# Altium project DashDataDisplay.PrjPcb (part 2 of 2)

## Sheet ADCCircuit.SchDoc
size 420 x 297 mm; SheetNumber: 6; SheetTotal: 9
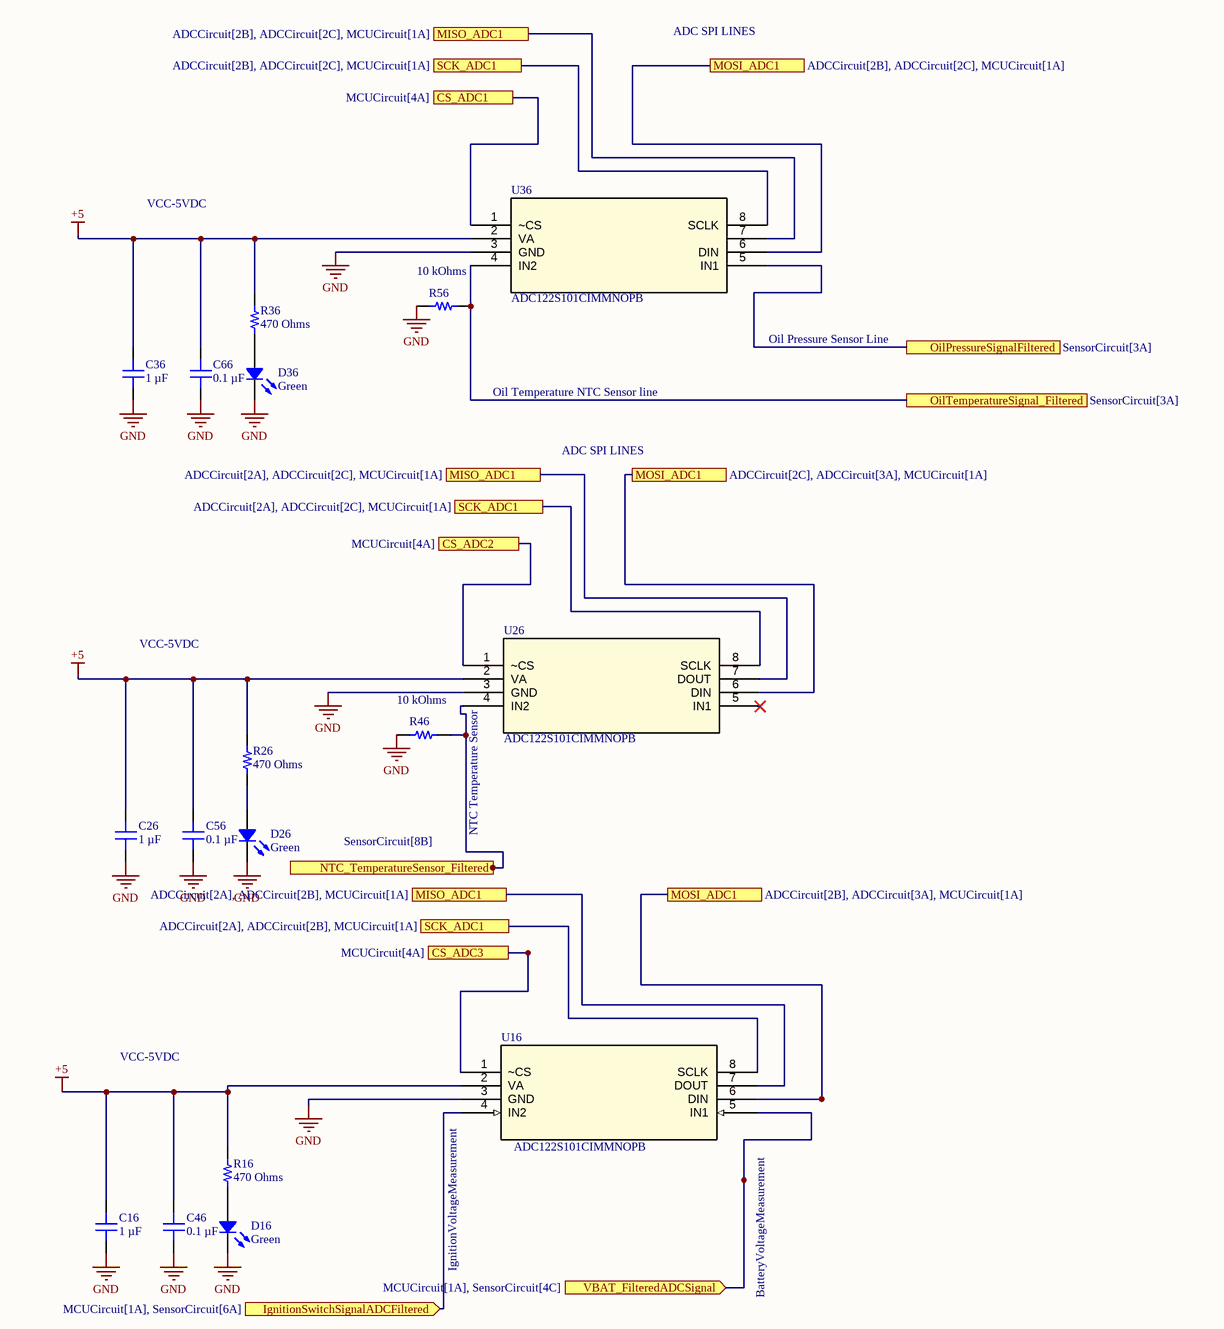
[diagram p6: ADCCircuit.SchDoc]

### Parts
C16  1 µF  [C0805]
C26  1 µF  [C0805]
C36  1 µF  [C0805]
C46  0.1 µF  [C0805]
C56  0.1 µF  [C0805]
C66  0.1 µF  [C0805]
D16  Green  [LED 0805_2012 GREEN]
D26  Green  [LED 0805_2012 GREEN]
D36  Green  [LED 0805_2012 GREEN]
R16  470 Ohms  [RES 0805_2012]
R26  470 Ohms  [RES 0805_2012]
R36  470 Ohms  [RES 0805_2012]
R46  10 kOhms  [RES 0805_2012]
R56  10 kOhms  [RES 0805_2012]
U16  ADC122S101CIMMNOPB  [MUA08A]
U26  ADC122S101CIMMNOPB  [MUA08A]
U36  ADC122S101CIMMNOPB  [MUA08A]

### Ports
CS_ADC1 (see MCUCircuit[4A]), CS_ADC2 (see MCUCircuit[4A]), CS_ADC3 (see MCUCircuit[4A]), IgnitionSwitchSignalADCFiltered (in, see MCUCircuit[1A], SensorCircuit[6A]), MISO_ADC1 (see ADCCircuit[2A], ADCCircuit[2B], MCUCircuit[1A]), MISO_ADC1 (see ADCCircuit[2A], ADCCircuit[2C], MCUCircuit[1A]), MISO_ADC1 (see ADCCircuit[2B], ADCCircuit[2C], MCUCircuit[1A]), MOSI_ADC1 (see ADCCircuit[2B], ADCCircuit[2C], MCUCircuit[1A]), MOSI_ADC1 (see ADCCircuit[2B], ADCCircuit[3A], MCUCircuit[1A]), MOSI_ADC1 (see ADCCircuit[2C], ADCCircuit[3A], MCUCircuit[1A]), NTC_TemperatureSensor_Filtered (see SensorCircuit[8B]), OilPressureSignalFiltered (see SensorCircuit[3A]), OilTemperatureSignal_Filtered (see SensorCircuit[3A]), SCK_ADC1 (see ADCCircuit[2A], ADCCircuit[2B], MCUCircuit[1A]), SCK_ADC1 (see ADCCircuit[2A], ADCCircuit[2C], MCUCircuit[1A]), SCK_ADC1 (see ADCCircuit[2B], ADCCircuit[2C], MCUCircuit[1A]), VBAT_FilteredADCSignal (in, see MCUCircuit[1A], SensorCircuit[4C])

### Nets
+5: C16.2 C26.2 C36.2 C46.2 C56.2 C66.2 R16.2 R26.2 R36.2 U16.2(VA) U26.2(VA) U36.2(VA)
GND: C16.1 C26.1 C36.1 C46.1 C56.1 C66.1 D16.2 D26.2 D36.2 R46.1 R56.1 U16.3(GND) U26.3(GND) U36.3(GND)
NetC72_2: U36.5(IN1) ; port OilPressureSignalFiltered
NetC82_2: R56.2 U36.4(IN2) ; port OilTemperatureSignal_Filtered
NetC152_2: R46.2 U26.4(IN2) ; port NTC_TemperatureSensor_Filtered
NetD16_1: D16.1 R16.1
NetD26_1: D26.1 R26.1
NetD36_1: D36.1 R36.1
NetR75_1: U16.8(SCLK) U26.8(SCLK) U36.8(SCLK) ; port SCK_ADC1
NetR85_1: U16.6(DIN) U26.6(DIN) U36.6(DIN) ; port MOSI_ADC1
NetR92_2: U16.5(IN1) ; port VBAT_FilteredADCSignal
NetR95_1: U16.7(DOUT) U26.7(DOUT) U36.7(DOUT) ; port MISO_ADC1
NetR222_2: U16.4(IN2) ; port IgnitionSwitchSignalADCFiltered
NetU15_17: U36.1(~CS) ; port CS_ADC1
NetU15_18: U26.1(~CS) ; port CS_ADC2
NetU15_33: U16.1(~CS) ; port CS_ADC3

Not connected (* = marked no-connect by the designer): U26 5(IN1)*

### Notes on the sheet
- ADC SPI LINES
- VCC-5VDC
- Oil Pressure Sensor Line
- Oil Temperature NTC Sensor line
- NTC Temperature Sensor
- (near U16) IgnitionVoltageMeasurement
- (near U16) BatteryVoltageMeasurement
- THIS DOCUMENT AND THE DATA DISCLOSED HEREIN OR
- HEREWITH IS THE PROPERTY OF ALTIUM LIMITED AND MAY
- DWG NO:
- REVISION
- REV:
- DESCRIPTION
- DATE
- APPROVED
- BE FREELY DISTRIBUTED IN WHOLE. NO RIGHTS ARE
- RESERVED OR EXPRESS OR IMPLIED WARANTEE GIVEN.
- ENG:
- APPROVALS
- PROJECT
- DSN:
- CHK:
- REFERENCE DOCUMENTS
- PROJECT REVISION:
- TITLE
- DOCUMENT REVISION:
- DESIGN ITEM:
- BOM:
- FAB DWG:
- PCB DWG:
- ASSY DWG:
- SCALE:
- A3
- SIZE
- CAGE CODE
- FILE NAME
- DWG NO.
- SHEET
- OF
- REV

### Library data of the parts
C16 C26 C36 = EMK212B7105KGHTR: CAP CER 1UF 16V X7R 0805; manufacturer: Taiyo Yuden; Tolerance: ±10%; Part Number: EMK212B7105KGHTR; Value: 1 µF; Applications: Automotive; Capacitance: 1 µF; componentlink1description: Datasheet; componentlink1url: https://ds.yuden.co.jp/TYCOMPAS/ut/detail?pn=EMK212B7105KGHTR &u=M; componentlink2description: DigiKey Link; componentlink2url: https://www.digikey.com/en/products/detail/taiyo-yuden/EMK212B7105KGHTR/6563155; Device Package: 0805 (2012 Metric); lastupdated: 2/9/2024 20:16:06; Lifecycle Status: Active; Minimum Order: 1; Mounting Type: Surface Mount, MLCC; Operating Temperature: -55°C ~ 125°C; Package / Case: 0805 (2012 Metric); packaging: TapeAndReel; partid: 3641; Part Status: Active; price: 0.03; Ratings: AEC-Q200; series: M; Size / Dimension: 0.079" L x 0.049" W (2.00mm x 1.25mm); Supplier 1: DigiKey; Supplier Part Number 1: 587-6310-1-ND; Temperature Coefficient: X7R; Thickness (Max): 0.053" (1.35mm); Voltage - Rated: 16V
C46 C56 C66 = 0805B104K160CT: CAP CER 0.1UF 16V X7R 0805; manufacturer: Walsin Technology Corporation; Tolerance: ±10%; Part Number: 0805B104K160CT; Value: 0.1 µF; Applications: General Purpose; Capacitance: 0.1 µF; componentlink1description: Datasheet; componentlink1url: http://www.passivecomponent.com/wp-content/uploads/2018/10/MLCC.pdf; componentlink2description: DigiKey Link; componentlink2url: https://www.digikey.com/en/products/detail/walsin-technology-corporation/0805B104K160CT/9355062; Device Package: 0805 (2012 Metric); lastupdated: 2/9/2024 20:16:02; Lifecycle Status: Active; Minimum Order: 1; Mounting Type: Surface Mount, MLCC; Operating Temperature: -55°C ~ 125°C; Package / Case: 0805 (2012 Metric); packaging: TapeAndReel; partid: 4882; Part Status: Active; price: 0.01; series: -; Size / Dimension: 0.079" L x 0.049" W (2.00mm x 1.25mm); Supplier 1: DigiKey; Supplier Part Number 1: 1292-1565-1-ND; Temperature Coefficient: X7R; Thickness (Max): 0.035" (0.90mm); Voltage - Rated: 16V
D16 D26 D36 = SM0805UGC: LED GREEN CLEAR 0805 SMD; Manufacturer: Bivar Inc.; Configuration: Standard; Current - Test: 20mA; Lens Color: Colorless; Lens Size: 1.40mm x 1.20mm; Lens Style: Rectangle with Flat Top; Millicandela Rating: 10mcd; Viewing Angle: 130°; Voltage - Forward (Vf) (Typ): 2V; Wavelength - Dominant: 565nm; Wavelength - Peak: 563nm; Part Number: SM0805UGC; Color: Green; ComponentLink1Description: Datasheet; ComponentLink1URL: https://www.bivar.com/Files/Datasheets/SM0805UGC.pdf; ComponentLink2Description: DigiKey Link; ComponentLink2URL: https://www.digikey.com/en/products/detail/bivar-inc/SM0805UGC/2408549; Device Package: 0805 (2012 Metric); Height (Max): 1.10mm; LastUpdated: 3/11/2024 07:52:46; Lens Transparency: Clear; Lifecycle Status: Active; Minimum Order: 1; Mounting Type: Surface Mount; Package / Case: 0805 (2012 Metric); Packaging: TapeAndReel; PartId: 247; Part Status: Active; Price: 0.19; Series: -; Size / Dimension: 2.00mm L x 1.20mm W; Supplier 1: DigiKey; Supplier Part Number 1: 492-1329-1-ND; Supplier Device Package: 0805; Value: Green
R16 R26 R36 = AC0805JR-07470RL: RES SMD 470 OHM 5% 1/8W 0805; Manufacturer: Yageo; Power (Watts): 0.125W, 1/8W; Temperature Coefficient: ±100ppm/°C; Part Number: AC0805JR-07470RL; Value: 470 Ohms; ComponentLink1Description: Datasheet; ComponentLink1URL: https://www.yageo.com/upload/media/product/productsearch/datasheet/rchip/PYu-AC_51_RoHS_L_7.pdf; ComponentLink2Description: DigiKey Link; ComponentLink2URL: https://www.digikey.com/en/products/detail/yageo/AC0805JR-07470RL/5897150; Composition: Thick Film; Device Package: 0805 (2012 Metric); Features: Automotive AEC-Q200, Moisture Resistant; Height - Seated (Max): 0.024" (0.60mm); LastUpdated: 2/8/2024 21:01:17; Lifecycle Status: Active; Minimum Order: 1; Number of Terminations: 2; Operating Temperature: -55°C ~ 155°C; Package / Case: 0805 (2012 Metric); Packaging: TapeAndReel; PartId: 46466; Part Status: Active; Price: 0.01; Ratings: AEC-Q200; Resistance: 470 Ohms; Series: AC; Size / Dimension: 0.079" L x 0.049" W (2.00mm x 1.25mm); Supplier 1: DigiKey; Supplier Part Number 1: YAG3791CT-ND; Supplier Device Package: 0805; Tolerance: ±5%
R46 R56 = 9-2176375-1: RES 10K OHM 0.1% 1/5W 0805; Manufacturer: TE Connectivity Passive Product; Power (Watts): 0.2W, 1/5W; Temperature Coefficient: ±10ppm/°C; Part Number: 9-2176375-1; Value: 10 kOhms; ComponentLink1Description: Datasheet; ComponentLink1URL: https://www.te.com/usa-en/product-9-2176375-1.datasheet.pdf; ComponentLink2Description: DigiKey Link; ComponentLink2URL: https://www.digikey.com/en/products/detail/te-connectivity-passive-product/9-2176375-1/18110542; Composition: Thin Film; Device Package: 0805 (2012 Metric); Features: Anti-Sulfur, Automotive AEC-Q200, Moisture Resistant; Height - Seated (Max): 0.026" (0.65mm); LastUpdated: 2/8/2024 21:00:11; Lifecycle Status: Active; Minimum Order: 1; Number of Terminations: 2; Operating Temperature: -55°C ~ 155°C; Package / Case: 0805 (2012 Metric); Packaging: TapeAndReel; PartId: 76290; Part Status: Active; Price: 0.39; Ratings: AEC-Q200; Resistance: 10 kOhms; Series: RQ73; Size / Dimension: 0.079" L x 0.049" W (2.00mm x 1.25mm); Supplier 1: DigiKey; Supplier Part Number 1: 1712-9-2176375-1CT-ND; Supplier Device Package: 0805; Tolerance: ±0.1%
U16 U26 U36 = ADC122S101CIMMNOPB: No Description Available; Mfr_Name: Texas Instruments; Type: ADC122S101CIMM; RefDes: RefDes

## Sheet ThermoCoupleCircuit.SchDoc
size A; SheetNumber: 7; SheetTotal: 9
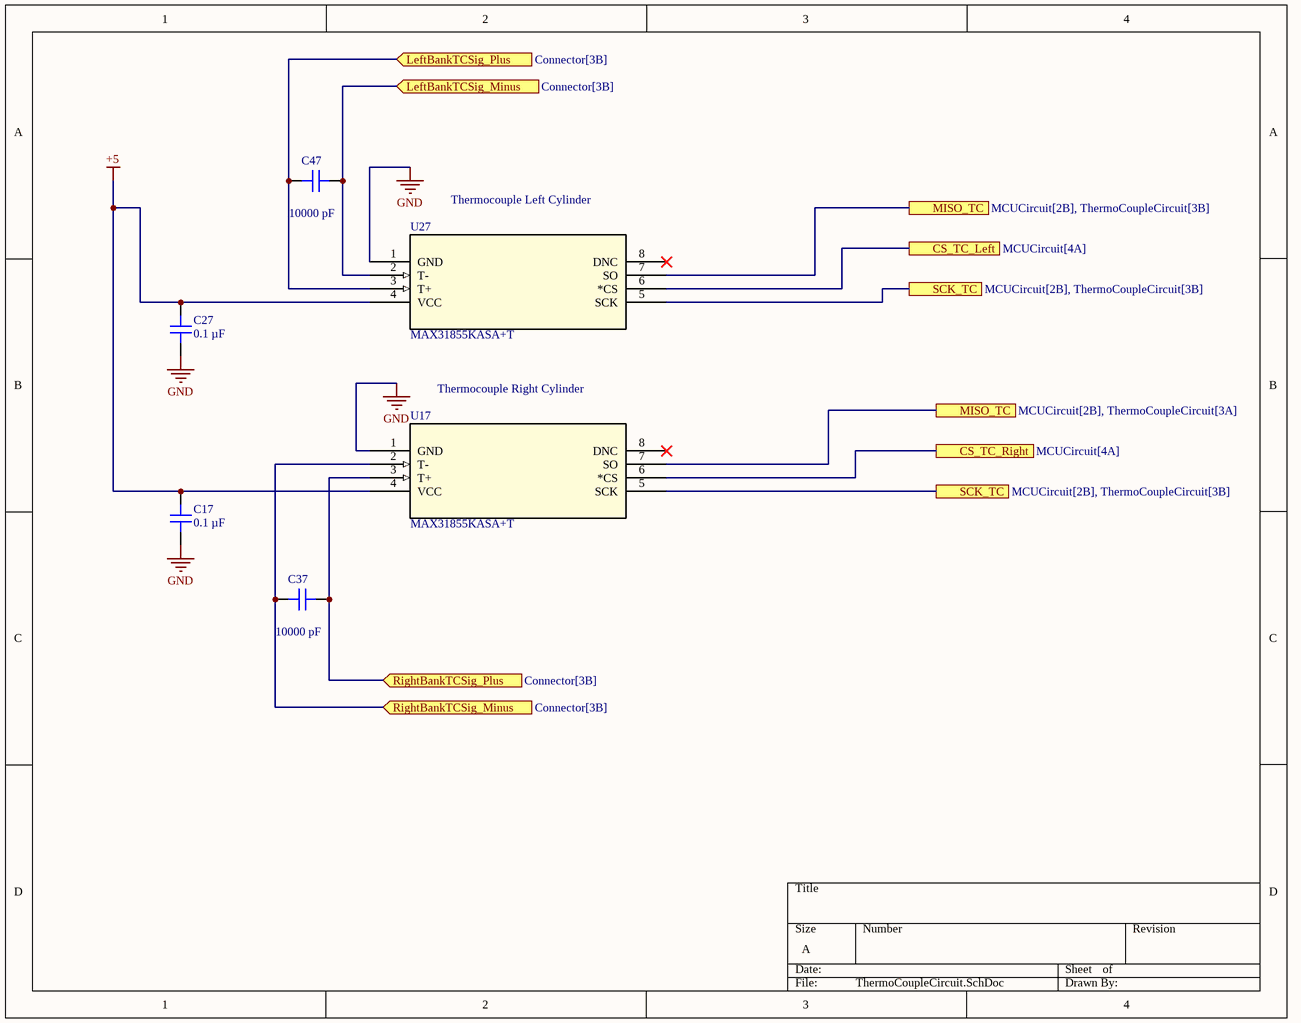
[diagram p7: ThermoCoupleCircuit.SchDoc]

### Parts
C17  0.1 µF  [C0805]
C27  0.1 µF  [C0805]
C37  10000 pF  [C0805]
C47  10000 pF  [C0805]
U17  MAX31855KASA+T  [21-0041B_8_MXM]
U27  MAX31855KASA+T  [21-0041B_8_MXM]

### Ports
CS_TC_Left (see MCUCircuit[4A]), CS_TC_Right (see MCUCircuit[4A]), LeftBankTCSig_Minus (in, see Connector[3B]), LeftBankTCSig_Plus (in, see Connector[3B]), MISO_TC (see MCUCircuit[2B], ThermoCoupleCircuit[3A]), MISO_TC (see MCUCircuit[2B], ThermoCoupleCircuit[3B]), RightBankTCSig_Minus (in, see Connector[3B]), RightBankTCSig_Plus (in, see Connector[3B]), SCK_TC (see MCUCircuit[2B], ThermoCoupleCircuit[3B])

### Nets
+5: C17.2 C27.1 U17.4(VCC) U27.4(VCC)
GND: C17.1 C27.2 U17.1(GND) U27.1(GND)
NetC37_1: C37.1 U17.2(T-) ; port RightBankTCSig_Minus
NetC37_2: C37.2 U17.3(T+) ; port RightBankTCSig_Plus
NetC47_1: C47.1 U27.3(T+) ; port LeftBankTCSig_Plus
NetC47_2: C47.2 U27.2(T-) ; port LeftBankTCSig_Minus
NetLCD14_6: U17.5(SCK) U27.5(SCK) ; port SCK_TC
NetR105_1: U17.7(SO) U27.7(SO) ; port MISO_TC
NetU15_15: U27.6(*CS) ; port CS_TC_Left
NetU15_16: U17.6(*CS) ; port CS_TC_Right

Not connected (* = marked no-connect by the designer): U17 8(DNC)*; U27 8(DNC)*

### Notes on the sheet
- Thermocouple Left Cylinder
- Thermocouple Right Cylinder

### Library data of the parts
C17 C27 = 0805B104K160CT: as C46 on sheet ADCCircuit; Part Number: 0805B104K160CT; Value: 0.1 µF; Applications: General Purpose; Capacitance: 0.1 µF; componentlink1description: Datasheet; componentlink1url: http://www.passivecomponent.com/wp-content/uploads/2018/10/MLCC.pdf; componentlink2description: DigiKey Link; componentlink2url: https://www.digikey.com/en/products/detail/walsin-technology-corporation/0805B104K160CT/9355062; Device Package: 0805 (2012 Metric); lastupdated: 2/9/2024 20:16:02; Lifecycle Status: Active; Minimum Order: 1; Mounting Type: Surface Mount, MLCC; Operating Temperature: -55°C ~ 125°C; Package / Case: 0805 (2012 Metric); packaging: TapeAndReel; partid: 4882; Part Status: Active; price: 0.01; series: -; Size / Dimension: 0.079" L x 0.049" W (2.00mm x 1.25mm); Supplier 1: DigiKey; Supplier Part Number 1: 1292-1565-1-ND; Temperature Coefficient: X7R; Thickness (Max): 0.035" (0.90mm); Voltage - Rated: 16V
C37 C47 = C0805C103K4REC7800: CAP CER 0805 10NF 16V X7R 10%; manufacturer: KEMET; Part Number: C0805C103K4REC7800; Value: 10000 pF; Applications: ESD Protection; Capacitance: 10000 pF; componentlink1description: Datasheet; componentlink1url: https://connect.kemet.com:7667/gateway/IntelliData-ComponentDocumentation/1.0/download/datasheet/C0805C103K4REC7800; componentlink2description: DigiKey Link; componentlink2url: https://www.digikey.com/en/products/detail/kemet/C0805C103K4REC7800/8643796; Device Package: 0805 (2012 Metric); lastupdated: 2/9/2024 20:14:57; Lifecycle Status: Active; Minimum Order: 1; Mounting Type: Surface Mount, MLCC; Operating Temperature: -55°C ~ 125°C; Package / Case: 0805 (2012 Metric); packaging: TapeAndReel; partid: 46019; Part Status: Active; price: 0.03; series: ESD SMD Comm X7R; Size / Dimension: 0.079" L x 0.049" W (2.00mm x 1.25mm); Supplier 1: DigiKey; Supplier Part Number 1: 399-C0805C103K4REC7800CT-ND; Temperature Coefficient: X7R; Thickness (Max): 0.035" (0.88mm); Tolerance: ±10%; Voltage - Rated: 16V
U17 U27 = MAX31855KASA+T: No Description Available; Mfr_Name: Analog Devices Inc; RefDes: RefDes; Type: Type

## Sheet Connector.SchDoc
size A; SheetNumber: 8; SheetTotal: 9
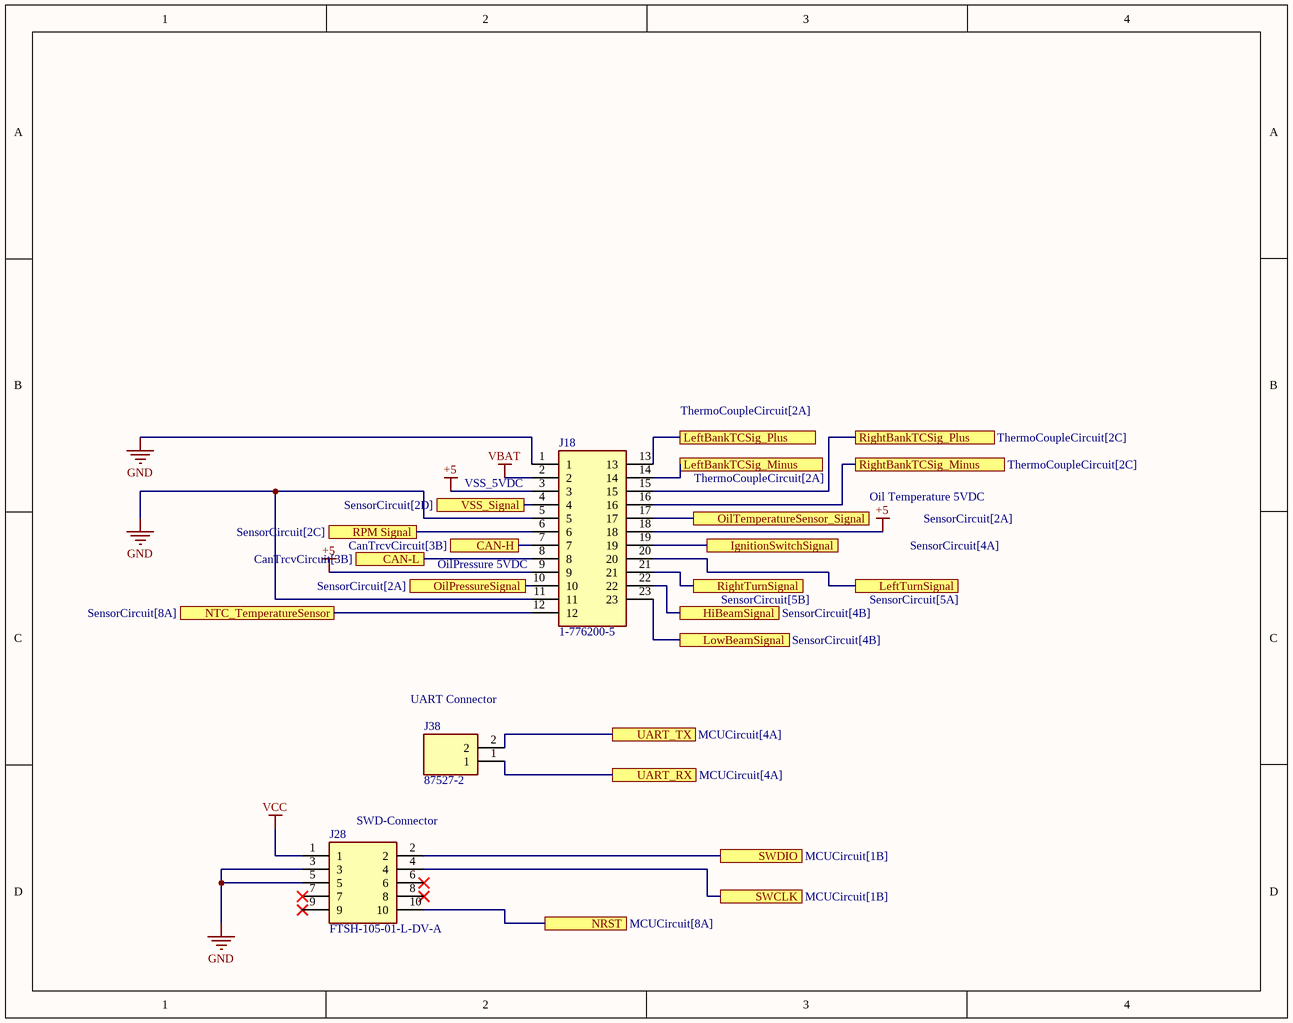
[diagram p8: Connector.SchDoc]

### Parts
J18  1-776200-5  [17762005]
J28  FTSH-105-01-L-DV-A  [FTSH-105-XX-YYY-DV-A]
J38  87527-2  [HDRV2W66P0X254_1X2_467X244X1044P]

### Ports
CAN-H (see CanTrcvCircuit[3B]), CAN-L (see CanTrcvCircuit[3B]), HiBeamSignal (see SensorCircuit[4B]), IgnitionSwitchSignal (see SensorCircuit[4A]), LeftBankTCSig_Minus (see ThermoCoupleCircuit[2A]), LeftBankTCSig_Plus (see ThermoCoupleCircuit[2A]), LeftTurnSignal (see SensorCircuit[5A]), LowBeamSignal (see SensorCircuit[4B]), NRST (see MCUCircuit[8A]), NTC_TemperatureSensor (see SensorCircuit[8A]), OilPressureSignal (see SensorCircuit[2A]), OilTemperatureSensor_Signal (see SensorCircuit[2A]), RightBankTCSig_Minus (see ThermoCoupleCircuit[2C]), RightBankTCSig_Plus (see ThermoCoupleCircuit[2C]), RightTurnSignal (see SensorCircuit[5B]), RPM Signal (see SensorCircuit[2C]), SWCLK (see MCUCircuit[1B]), SWDIO (see MCUCircuit[1B]), UART_RX (see MCUCircuit[4A]), UART_TX (see MCUCircuit[4A]), VSS_Signal (see SensorCircuit[2D])

### Nets
+5: J18.3 J18.9 J18.18
GND: J18.1 J18.5 J18.11 J28.3 J28.5
VBAT: J18.2
VCC: J28.1
NetC37_1: J18.16 ; port RightBankTCSig_Minus
NetC37_2: J18.15 ; port RightBankTCSig_Plus
NetC47_1: J18.13 ; port LeftBankTCSig_Plus
NetC47_2: J18.14 ; port LeftBankTCSig_Minus
NetC235_2: J28.10 ; port NRST
NetJ18_4: J18.4 ; port VSS_Signal
NetJ18_6: J18.6 ; port RPM Signal
NetJ18_7: J18.7 ; port CAN-H
NetJ18_8: J18.8 ; port CAN-L
NetJ18_10: J18.10 ; port OilPressureSignal
NetJ18_12: J18.12 ; port NTC_TemperatureSensor
NetJ18_17: J18.17 ; port OilTemperatureSensor_Signal
NetJ18_19: J18.19 ; port IgnitionSwitchSignal
NetJ18_20: J18.20 ; port LeftTurnSignal
NetJ18_21: J18.21 ; port RightTurnSignal
NetJ18_22: J18.22 ; port HiBeamSignal
NetJ18_23: J18.23 ; port LowBeamSignal
NetJ28_2: J28.2 ; port SWDIO
NetJ28_4: J28.4 ; port SWCLK
NetJ38_1: J38.1 ; port UART_RX
NetJ38_2: J38.2 ; port UART_TX

Not connected (* = marked no-connect by the designer): J28 6* 7* 8* 9*

### Notes on the sheet
- (near J18) VSS_5VDC
- Oil Temperature 5VDC
- (near J18) OilPressure 5VDC
- (near J38) UART Connector
- (near J28) SWD-Connector

### Library data of the parts
J18 = 1-776200-5: Connector; Manufacturer_Name: TE Connectivity; Datasheet Link: https://www.te.com/commerce/DocumentDelivery/DDEController?Action=showdoc&DocId=Customer+Drawing%7F776200%7FE%7Fpdf%7FEnglish%7FENG_CD_776200_E.pdf%7F1-776200-5; Height: 34.25mm; Manufacturer_Part_Number: 1-776200-5; Mouser Part Number: 571-1-776200-5; Mouser Price/Stock: https://www.mouser.co.uk/ProductDetail/TE-Connectivity-AMP/1-776200-5?qs=YqNA2qefETBJbWsdhRcFeA%3D%3D
J28 = FTSH-105-01-L-DV-A: Connector; Manufacturer_Name: SAMTEC; Datasheet Link: http://suddendocs.samtec.com/prints/ftsh-1xx-xx-xxx-dv-xxx-xxx-mkt.pdf; Manufacturer_Part_Number: FTSH-105-01-L-DV-A; Mouser Part Number: 200-FTSH10501LDVA; Mouser Price/Stock: https://www.mouser.co.uk/ProductDetail/Samtec/FTSH-105-01-L-DV-A?qs=vqM95g%252BRBeykLJELFbssPw%3D%3D; Arrow Part Number: FTSH-105-01-L-DV-A; Arrow Price/Stock: https://www.arrow.com/en/products/ftsh-105-01-l-dv-a/samtec
J38 = 87527-2: Connector; Manufacturer_Name: TE Connectivity; Datasheet Link: https://www.te.com/commerce/DocumentDelivery/DDEController?Action=showdoc&DocId=Customer+Drawing%7F87527%7FH%7Fpdf%7FEnglish%7FENG_CD_87527_H.pdf%7F87527-2; Height: 10.439mm; Manufacturer_Part_Number: 87527-2; Mouser Part Number: 571-875272; Mouser Price/Stock: https://www.mouser.co.uk/ProductDetail/TE-Connectivity/87527-2?qs=ZDXmSm13593hsB4j%252B6gMfg%3D%3D; Arrow Part Number: 87527-2; Arrow Price/Stock: https://www.arrow.com/en/products/87527-2/te-connectivity?region=nac

## Sheet ButtonCircuit.SchDoc
size A; SheetNumber: 9; SheetTotal: 9
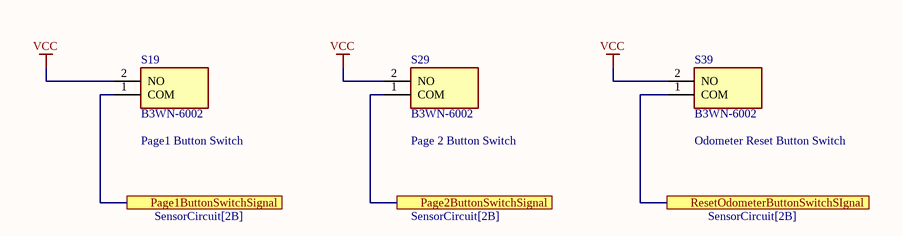
[diagram p9: ButtonCircuit.SchDoc]

### Parts
S19  B3WN-6002  [B3WN6002]
S29  B3WN-6002  [B3WN6002]
S39  B3WN-6002  [B3WN6002]

### Ports
Page1ButtonSwitchSignal (see SensorCircuit[2B]), Page2ButtonSwitchSignal (see SensorCircuit[2B]), ResetOdometerButtonSwitchSIgnal (see SensorCircuit[2B])

### Nets
VCC: S19.2(NO) S29.2(NO) S39.2(NO)
NetR42_1: S39.1(COM) ; port ResetOdometerButtonSwitchSIgnal
NetR52_1: S29.1(COM) ; port Page2ButtonSwitchSignal
NetR62_1: S19.1(COM) ; port Page1ButtonSwitchSignal

### Notes on the sheet
- (near S19) Page1 Button Switch
- (near S29) Page 2 Button Switch
- (near S39) Odometer Reset Button Switch

### Library data of the parts
S19 S29 S39 = B3WN-6002: Switch; Manufacturer_Name: Omron Electronics; Datasheet Link: http://omronfs.omron.com/en_US/ecb/products/pdf/en-b3wn.pdf; Height: 13.2mm; Manufacturer_Part_Number: B3WN-6002; Mouser Part Number: 653-B3WN-6002; Mouser Price/Stock: https://www.mouser.co.uk/ProductDetail/Omron-Electronics/B3WN-6002?qs=CX134%252BdLMDH3t3DGk60Xxw%3D%3D; Arrow Part Number: B3WN-6002; Arrow Price/Stock: https://www.arrow.com/en/products/b3wn-6002/omron?region=europe

## Nets that join several sheets
+5: PowerSupply (C41.1 L21.2 R21.2 U21.4), CanTrcvCircuit (C13.2 U13.3), LCDCircuit (LCD14.2 LCD14.19 R14.1), MCUCircuit (Q15.3), ADCCircuit (12 pins), ThermoCoupleCircuit (C17.2 C27.1 U17.4 U27.4), Connector (J18.3 J18.9 J18.18)
GND: PowerSupply (12 pins), SensorCircuit (38 pins), CanTrcvCircuit (C13.1 R13.2 U13.2), LCDCircuit (LCD14.1 LCD14.15 LCD14.20 R14.3), MCUCircuit (31 pins), ADCCircuit (14 pins), ThermoCoupleCircuit (C17.1 C27.2 U17.1 U27.1), Connector (5 pins)
VBAT: PowerSupply (C11.1 C21.1 U11.1 U21.1), SensorCircuit (R32.1), Connector (J18.2)
VCC: PowerSupply (C31.1 L11.2 R11.2 U11.4), SensorCircuit (11 pins), MCUCircuit (26 pins), Connector (J28.1), ButtonCircuit (S19.2 S29.2 S39.2)
NetC37_1: ThermoCoupleCircuit (C37.1 U17.2), Connector (J18.16)
NetC37_2: ThermoCoupleCircuit (C37.2 U17.3), Connector (J18.15)
NetC47_1: ThermoCoupleCircuit (C47.1 U27.3), Connector (J18.13)
NetC47_2: ThermoCoupleCircuit (C47.2 U27.2), Connector (J18.14)
NetC72_2: SensorCircuit (C72.2 R72.2), ADCCircuit (U36.5)
NetC82_2: SensorCircuit (C82.2 R82.2), ADCCircuit (R56.2 U36.4)
NetC152_2: SensorCircuit (C152.2 R302.2), ADCCircuit (R46.2 U26.4)
NetC235_2: MCUCircuit (C235.2 R35.1 U15.14), Connector (J28.10)
NetJ18_4: SensorCircuit (R12.1), Connector (J18.4)
NetJ18_6: SensorCircuit (R22.1), Connector (J18.6)
NetJ18_7: CanTrcvCircuit (R23.2 U13.7), Connector (J18.7)
NetJ18_8: CanTrcvCircuit (R23.1 U13.6), Connector (J18.8)
NetJ18_10: SensorCircuit (R72.1), Connector (J18.10)
NetJ18_12: SensorCircuit (R302.1), Connector (J18.12)
NetJ18_17: SensorCircuit (R82.1), Connector (J18.17)
NetJ18_19: SensorCircuit (R212.1), Connector (J18.19)
NetJ18_20: SensorCircuit (R202.1), Connector (J18.20)
NetJ18_21: SensorCircuit (R192.1), Connector (J18.21)
NetJ18_22: SensorCircuit (R172.1), Connector (J18.22)
NetJ18_23: SensorCircuit (R182.1), Connector (J18.23)
NetJ28_2: MCUCircuit (U15.72), Connector (J28.2)
NetJ28_4: MCUCircuit (U15.76), Connector (J28.4)
NetJ38_1: MCUCircuit (U15.79), Connector (J38.1)
NetJ38_2: MCUCircuit (U15.78), Connector (J38.2)
NetLCD14_4: LCDCircuit (LCD14.4), MCUCircuit (U15.51)
NetLCD14_5: LCDCircuit (LCD14.5), MCUCircuit (R125.1)
NetLCD14_6: LCDCircuit (LCD14.6), MCUCircuit (R115.1), ThermoCoupleCircuit (U17.5 U27.5)
NetQ12_3: SensorCircuit (Q12.3 R112.2), MCUCircuit (U15.29)
NetQ22_3: SensorCircuit (Q22.3 R122.2), MCUCircuit (U15.26)
NetQ32_3: SensorCircuit (Q32.3 R132.2), MCUCircuit (U15.43)
NetQ42_3: SensorCircuit (Q42.3 R142.2), MCUCircuit (U15.42)
NetQ52_3: SensorCircuit (Q52.3 R152.2), MCUCircuit (U15.41)
NetQ62_3: SensorCircuit (Q62.3 R162.2), MCUCircuit (U15.57)
NetQ72_3: SensorCircuit (Q72.3 R252.2), MCUCircuit (U15.61)
NetQ82_3: SensorCircuit (Q82.3 R262.2), MCUCircuit (U15.58)
NetQ92_3: SensorCircuit (Q92.3 R272.2), MCUCircuit (U15.60)
NetQ102_3: SensorCircuit (Q102.3 R282.2), MCUCircuit (U15.59)
NetQ112_3: SensorCircuit (Q112.3 R292.2), MCUCircuit (U15.25)
NetR42_1: SensorCircuit (R42.1), ButtonCircuit (S39.1)
NetR52_1: SensorCircuit (R52.1), ButtonCircuit (S29.1)
NetR62_1: SensorCircuit (R62.1), ButtonCircuit (S19.1)
NetR75_1: MCUCircuit (R75.1), ADCCircuit (U16.8 U26.8 U36.8)
NetR85_1: MCUCircuit (R85.1), ADCCircuit (U16.6 U26.6 U36.6)
NetR92_2: SensorCircuit (R92.2 R102.1), MCUCircuit (U15.23), ADCCircuit (U16.5)
NetR95_1: MCUCircuit (R95.1), ADCCircuit (U16.7 U26.7 U36.7)
NetR105_1: MCUCircuit (R105.1), ThermoCoupleCircuit (U17.7 U27.7)
NetR222_2: SensorCircuit (R222.2 R232.1), MCUCircuit (U15.24), ADCCircuit (U16.4)
NetU13_1: CanTrcvCircuit (U13.1), MCUCircuit (U15.96)
NetU13_4: CanTrcvCircuit (U13.4), MCUCircuit (U15.95)
NetU15_15: MCUCircuit (U15.15), ThermoCoupleCircuit (U27.6)
NetU15_16: MCUCircuit (U15.16), ThermoCoupleCircuit (U17.6)
NetU15_17: MCUCircuit (U15.17), ADCCircuit (U36.1)
NetU15_18: MCUCircuit (U15.18), ADCCircuit (U26.1)
NetU15_33: MCUCircuit (U15.33), ADCCircuit (U16.1)